# Altium schematic sheet MainSch.SchDoc: Main Schematic - RTD Measurement Board
size A; Author: Enrique Morell; SheetNumber: 1; SheetTotal: 15
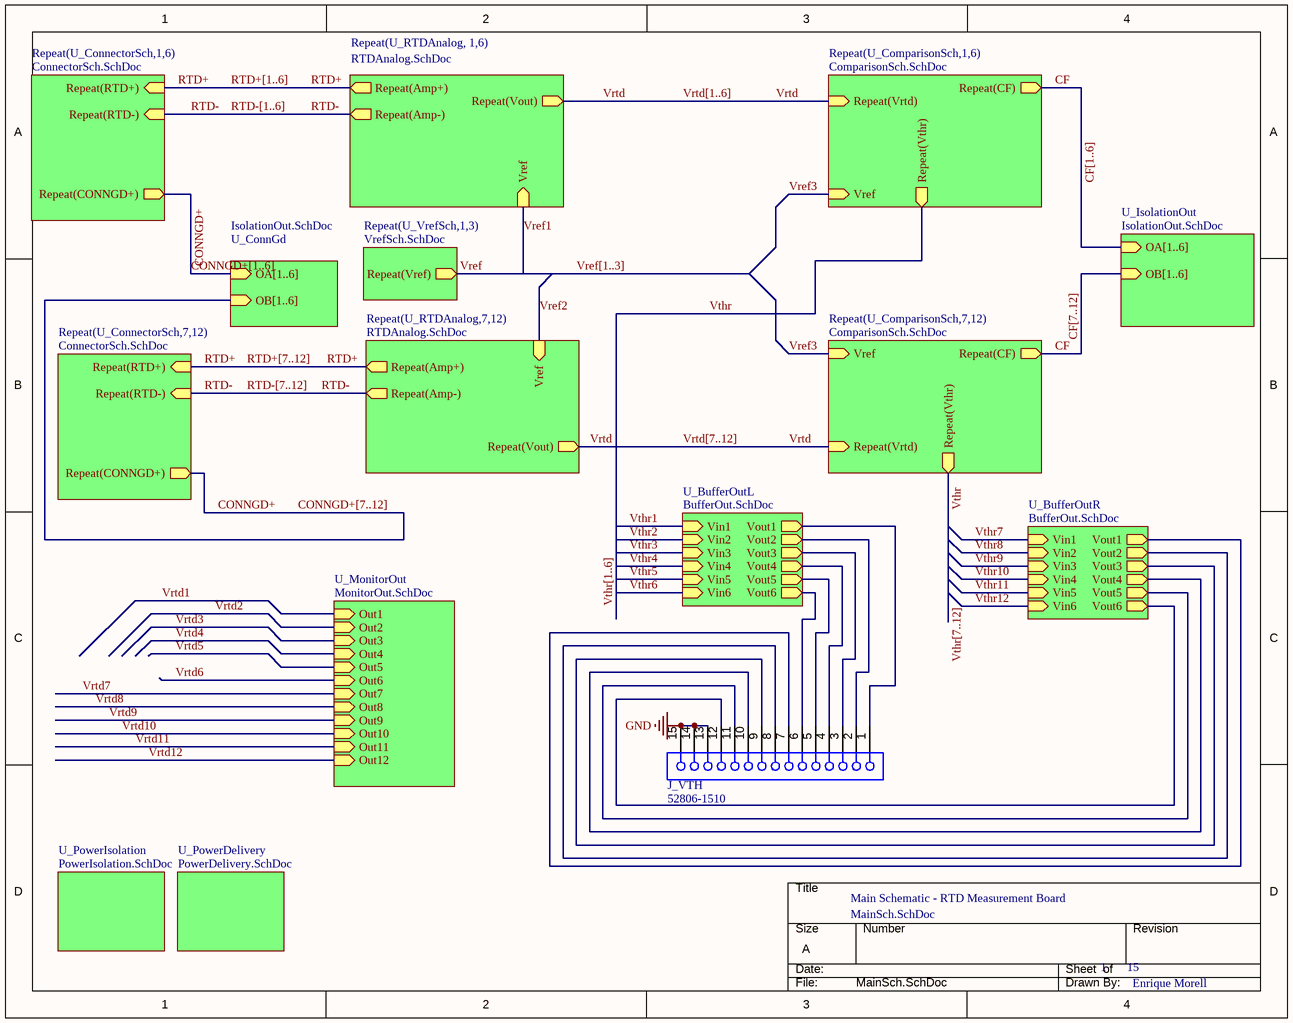
[diagram p0: MainSch.SchDoc]

## Parts
J_VTH  52806-1510  [MOLX-52806-1510]

## Sub-sheets
Repeat(U_ComparisonSch,1,6) = ComparisonSch.SchDoc: Vref (in), Repeat(Vrtd) (in), Repeat(CF) (out), Repeat(Vthr) (out)
Repeat(U_ComparisonSch,7,12) = ComparisonSch.SchDoc: Vref (in), Repeat(Vrtd) (in), Repeat(CF) (out), Repeat(Vthr) (out)
Repeat(U_ConnectorSch,1,6) = ConnectorSch.SchDoc: Repeat(RTD+) (in), Repeat(RTD-) (in), Repeat(CONNGD+) (out)
Repeat(U_ConnectorSch,7,12) = ConnectorSch.SchDoc: Repeat(RTD+) (in), Repeat(RTD-) (in), Repeat(CONNGD+) (out)
Repeat(U_RTDAnalog,7,12) = RTDAnalog.SchDoc: Repeat(Amp+) (out), Vref (in), Repeat(Vout) (out), Repeat(Amp-) (out)
Repeat(U_RTDAnalog, 1,6) = RTDAnalog.SchDoc: Vref (in), Repeat(Amp+) (out), Repeat(Vout) (out), Repeat(Amp-) (out)
Repeat(U_VrefSch,1,3) = VrefSch.SchDoc: Repeat(Vref) (out)
U_BufferOutL = BufferOut.SchDoc: Vin1 (in), Vout1 (out), Vin2 (in), Vout2 (out), Vin3 (in), Vout3 (out), Vin4 (in), Vout4 (out), Vin5 (in), Vout5 (out), Vin6 (in), Vout6 (out)
U_BufferOutR = BufferOut.SchDoc: Vin1 (in), Vout1 (out), Vin2 (in), Vout2 (out), Vin3 (in), Vout3 (out), Vin4 (in), Vout4 (out), Vin5 (in), Vout5 (out), Vin6 (in), Vout6 (out)
U_ConnGd = IsolationOut.SchDoc: OA[1..6] (in), OB[1..6] (in)
U_IsolationOut = IsolationOut.SchDoc: OA[1..6] (in), OB[1..6] (in)
U_MonitorOut = MonitorOut.SchDoc: Out1 (in), Out2 (in), Out3 (in), Out4 (in), Out5 (in), Out6 (in), Out7 (in), Out9 (in), Out10 (in), Out11 (in), Out12 (in), Out8 (in)
U_PowerDelivery = PowerDelivery.SchDoc: no entries
U_PowerIsolation = PowerIsolation.SchDoc: no entries

## Nets
GND: J_VTH.13 J_VTH.14 J_VTH.15
CF: sheet Repeat(U_ComparisonSch,1,6)/Repeat(CF), sheet Repeat(U_ComparisonSch,7,12)/Repeat(CF)
CONNGD+: sheet Repeat(U_ConnectorSch,1,6)/Repeat(CONNGD+), sheet Repeat(U_ConnectorSch,7,12)/Repeat(CONNGD+)
RTD+: sheet Repeat(U_RTDAnalog, 1,6)/Repeat(Amp+), sheet Repeat(U_RTDAnalog,7,12)/Repeat(Amp+), sheet Repeat(U_ConnectorSch,1,6)/Repeat(RTD+), sheet Repeat(U_ConnectorSch,7,12)/Repeat(RTD+)
RTD-: sheet Repeat(U_RTDAnalog, 1,6)/Repeat(Amp-), sheet Repeat(U_RTDAnalog,7,12)/Repeat(Amp-), sheet Repeat(U_ConnectorSch,1,6)/Repeat(RTD-), sheet Repeat(U_ConnectorSch,7,12)/Repeat(RTD-)
Vref: sheet Repeat(U_VrefSch,1,3)/Repeat(Vref)
Vref1: sheet Repeat(U_RTDAnalog, 1,6)/Vref
Vref2: sheet Repeat(U_RTDAnalog,7,12)/Vref
Vref3: sheet Repeat(U_ComparisonSch,1,6)/Vref, sheet Repeat(U_ComparisonSch,7,12)/Vref
Vrtd: sheet Repeat(U_RTDAnalog, 1,6)/Repeat(Vout), sheet Repeat(U_RTDAnalog,7,12)/Repeat(Vout), sheet Repeat(U_ComparisonSch,1,6)/Repeat(Vrtd), sheet Repeat(U_ComparisonSch,7,12)/Repeat(Vrtd)
Vrtd1: sheet U_MonitorOut/Out1
Vrtd2: sheet U_MonitorOut/Out2
Vrtd3: sheet U_MonitorOut/Out3
Vrtd4: sheet U_MonitorOut/Out4
Vrtd5: sheet U_MonitorOut/Out5
Vrtd6: sheet U_MonitorOut/Out6
Vrtd7: sheet U_MonitorOut/Out7
Vrtd8: sheet U_MonitorOut/Out8
Vrtd9: sheet U_MonitorOut/Out9
Vrtd10: sheet U_MonitorOut/Out10
Vrtd11: sheet U_MonitorOut/Out11
Vrtd12: sheet U_MonitorOut/Out12
Vthr: sheet Repeat(U_ComparisonSch,1,6)/Repeat(Vthr), sheet Repeat(U_ComparisonSch,7,12)/Repeat(Vthr)
Vthr1: sheet U_BufferOutL/Vin1
Vthr2: sheet U_BufferOutL/Vin2
Vthr3: sheet U_BufferOutL/Vin3
Vthr4: sheet U_BufferOutL/Vin4
Vthr5: sheet U_BufferOutL/Vin5
Vthr6: sheet U_BufferOutL/Vin6
Vthr7: sheet U_BufferOutR/Vin1
Vthr8: sheet U_BufferOutR/Vin2
Vthr9: sheet U_BufferOutR/Vin3
Vthr10: sheet U_BufferOutR/Vin4
Vthr11: sheet U_BufferOutR/Vin5
Vthr12: sheet U_BufferOutR/Vin6
NetJ_VTH_1: J_VTH.1 ; sheet U_BufferOutL/Vout1
NetJ_VTH_2: J_VTH.2 ; sheet U_BufferOutL/Vout2
NetJ_VTH_3: J_VTH.3 ; sheet U_BufferOutL/Vout3
NetJ_VTH_4: J_VTH.4 ; sheet U_BufferOutL/Vout4
NetJ_VTH_5: J_VTH.5 ; sheet U_BufferOutL/Vout5
NetJ_VTH_6: J_VTH.6 ; sheet U_BufferOutL/Vout6
NetJ_VTH_7: J_VTH.7 ; sheet U_BufferOutR/Vout1
NetJ_VTH_8: J_VTH.8 ; sheet U_BufferOutR/Vout2
NetJ_VTH_9: J_VTH.9 ; sheet U_BufferOutR/Vout3
NetJ_VTH_10: J_VTH.10 ; sheet U_BufferOutR/Vout4
NetJ_VTH_11: J_VTH.11 ; sheet U_BufferOutR/Vout5
NetJ_VTH_12: J_VTH.12 ; sheet U_BufferOutR/Vout6

## Buses and harness runs
bus CF[1..6] = sheet U_IsolationOut/OA[1..6]
bus CF[7..12] = sheet U_IsolationOut/OB[1..6]
bus CONNGD+[1..6] = sheet U_ConnGd/OA[1..6]
bus CONNGD+[7..12] = sheet U_ConnGd/OB[1..6]
bus RTD+[1..6]
bus RTD+[7..12]
bus RTD-[1..6]
bus RTD-[7..12]
bus Vref[1..3]
bus Vrtd[1..6]
bus Vrtd[7..12]
bus Vthr[1..6]
bus Vthr[7..12]

## Notes on the sheet
- THIS DOCUMENT AND THE DATA DISCLOSED HEREIN OR
- HEREWITH IS THE PROPERTY OF ALTIUM LIMITED AND MAY
- DWG NO:
- REVISION
- REV:
- DESCRIPTION
- DATE
- APPROVED
- BE FREELY DISTRIBUTED IN WHOLE. NO RIGHTS ARE
- RESERVED OR EXPRESS OR IMPLIED WARANTEE GIVEN.
- ENG:
- APPROVALS
- PROJECT
- DSN:
- CHK:
- REFERENCE DOCUMENTS
- PROJECT REVISION:
- TITLE
- DOCUMENT REVISION:
- DESIGN ITEM:
- BOM:
- FAB DWG:
- PCB DWG:
- ASSY DWG:
- SCALE:
- A3
- SIZE
- CAGE CODE
- FILE NAME
- DWG NO.
- SHEET
- OF
- REV

## Library data of the parts
J_VTH = CMP-1242-00172-1: 1.0 mm Pitch FFC Connector, 5.4 mm Mated Height, Vertical, Non-ZIF, Through Hole, 15 Circuits, -20 to 80 degC, ELV and RoHS Compliant, Tray; Manufacturer: Molex; Voltage (Max): 50V AC (RMS)/DC; Pitch - Mating Interface: 1.00mm; Circuits (maximum): 15; Durability (mating cycles max): 10; Stackable: No; Current (Max per Contact): 0.5A; Mated Height: 5.40mm; Material - Plating Mating: Tin; PCB Retention: None; Material - Metal: Phosphor Bronze; ComponentLink3URL: http://www.molex.com/pdm_docs/sd/528061510_sd.pdf; PartNumber: 52806-1510; ComponentLink2URL: http://www.molex.com/webdocs/datasheets/pdf/en-us/0528061510_FFC_FPC_CONNECTORS.pdf; PackageVersion: Rev. B, 08/2002; Pitch - Termination Interface: 1.00mm; Circuits (Loaded): 15; PackageDescription: 15-Lead FFC Connector, Pitch 1.0 mm; ComponentLink1URL: http://www.molex.com/molex/index.jsp; Packing: Tray; ComponentLink1Description: Manufacturer URL; Entry Angle: Vertical; Contact Position: N/A; PCB Locator: No; Number of Rows: 1; ComponentLink2Description: Datasheet; Material - Plating Termination: Tin; Orientation: Vertical; RoHS: TRUE; PackageReference: 52806-1510; ComponentLink3Description: Package Specification; Mounting Technology: Through Hole; Polarized to PCB: No